# EAGLE design modul_zasilania (EAGLE 9.7.0)
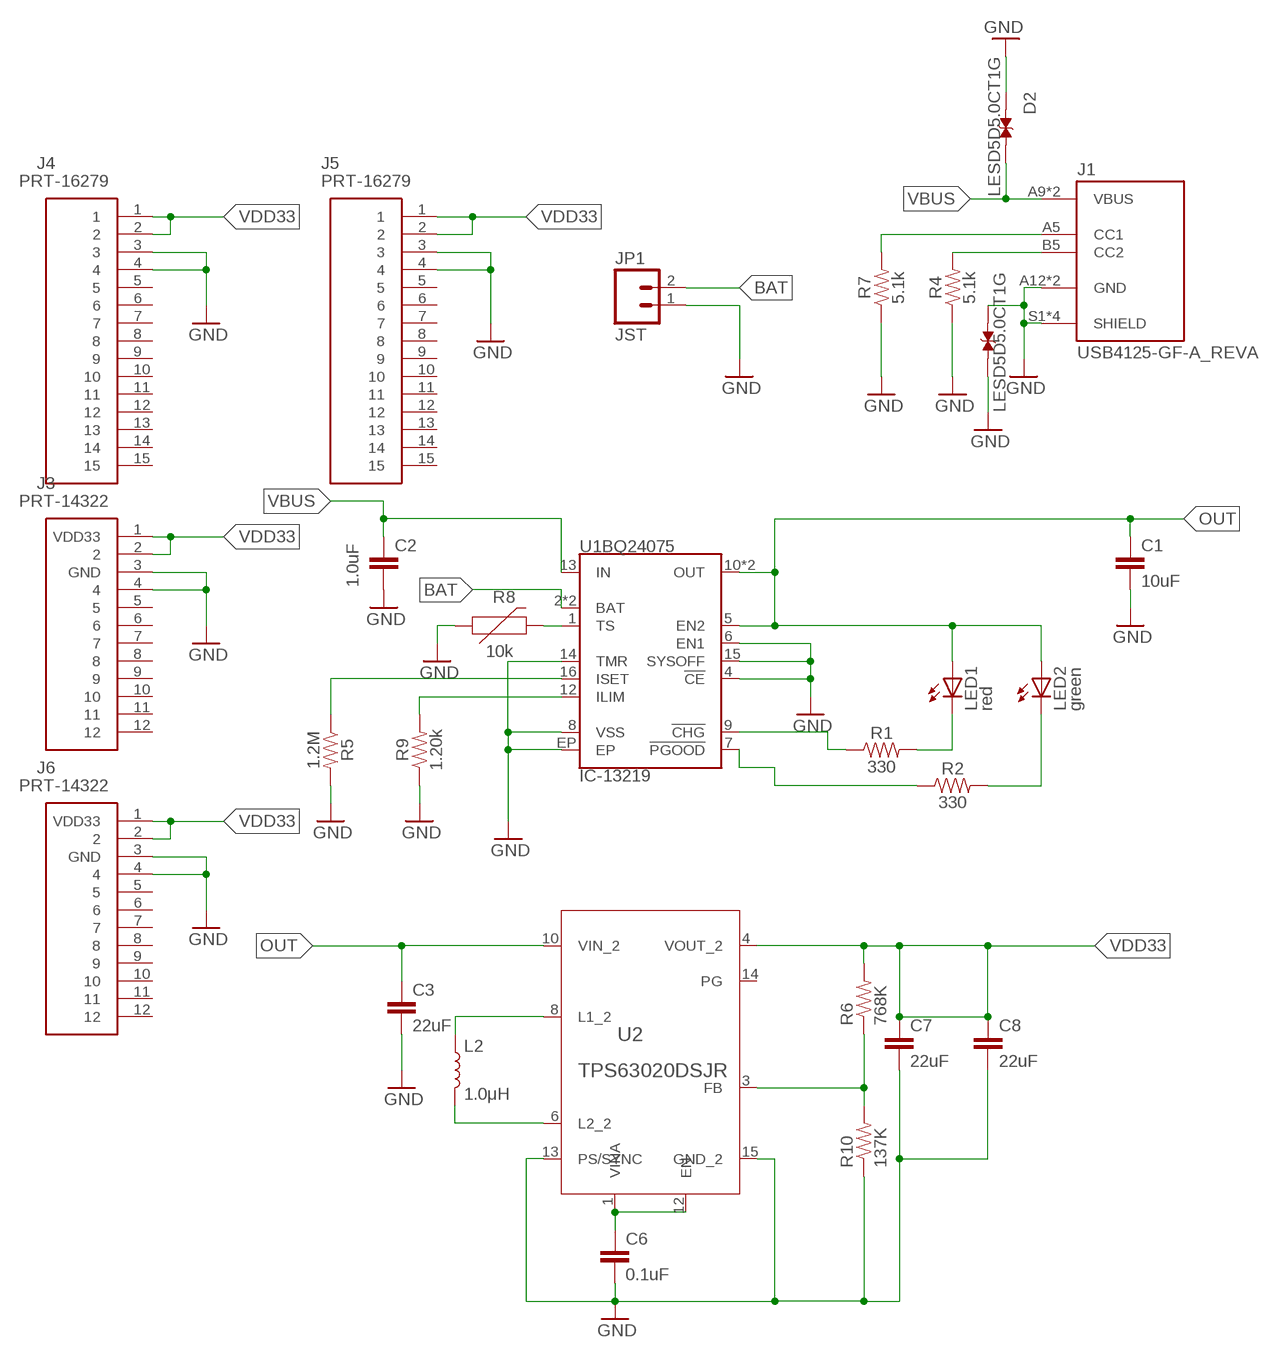
[diagram p0: schematic, sheet 1]

## Parts
C1  10uF  10UF-1206-6.3V-20%  [1206]
C2  1.0uF  1.0UF-0603-16V-10%  [0603]
C3  22uF  22UF-0603-6.3V-20%  [0603]
C6  0.1uF  0.1UF-0402-16V-10%  [0402]
C7  22uF  22UF-0603-6.3V-20%  [0603]
C8  22uF  22UF-0603-6.3V-20%  [0603]
D1  LESD5D5.0CT1G  [TVS_LESD5D5.0CT1G]
D2  LESD5D5.0CT1G  [TVS_LESD5D5.0CT1G]
J1  USB4125-GF-A_REVA  [GCT_USB4125-GF-A_REVA]
J3  PRT-14322  [RHDR12W87P0X254_1X12_3103X250X]
J4  PRT-16279  [PRT16279]
J5  PRT-16279  [PRT16279]
J6  PRT-14322  [RHDR12W87P0X254_1X12_3103X250X]
JP1  JST  M02-JST-2MM-SMT  [JST-2-SMD]
L2  1.0μH  1.0μH-0805_WIDE-1.0μH-1.4A-0.07OHM-1.4MM_H  [0805-WIDE]
LED1  red  LEDCHIP-LED0805  [CHIP-LED0805]
LED2  green  LEDCHIP-LED0805  [CHIP-LED0805]
R1  330  330OHM-0603-1/10W-1%  [0603]
R2  330  330OHM-0603-1/10W-1%  [0603]
R4  5.1k  5.1KOHM5.1KOHM-0603-1/10W-1%  [0603]
R5  1.2M  1.2MOHM-0603-1/10W-1%  [0603]
R6  768K  CRCW06034K70JNEAHP  [0603]
R7  5.1k  5.1KOHM5.1KOHM-0603-1/10W-1%  [0603]
R8  10k  NTC-THERMISTOR-0603  [0603@1]
R9  1.20k  1.20KOHM-0603-1/10W-1%  [0603]
R10  137K  CRCW06034K70JNEAHP  [0603]
U1BQ24075  IC-13219  BQ24075  [PVQFN-N16]
U2  TPS63020DSJR  [R-PVSON-N14]

## Nets
BAT [wires]: JP1.2 U1BQ24075.2(BAT) U1BQ24075.3(BAT)
GND [wires]: C1.2 C2.2 C3.2 C6.2 C7.2 C8.2 D1.1 D1.2 D2.1 J1.A12(GND) J1.B12(GND) J1.S1(SHIELD) J1.S2(SHIELD) J1.S3(SHIELD) J1.S4(SHIELD) J3.3(GND) J3.4 J4.3 J4.4 J5.3 J5.4 J6.3(GND) J6.4 JP1.1 R4.1 R5.2 R7.1 R8.1 R9.1 R10.1 U1BQ24075.4(!CE!) U1BQ24075.6(EN1) U1BQ24075.8(VSS) U1BQ24075.14(TMR) U1BQ24075.15(SYSOFF) U1BQ24075.EP U2.13(PS/SYNC) U2.15(GND_2)
LED1 [wires]: LED1.C R1.2
LED2 [wires]: LED2.C R2.2
N$1 [wires]: R8.2 U1BQ24075.1(TS)
N$2 [wires]: R5.1 U1BQ24075.16(ISET)
N$3 [wires]: J1.B5(CC2) R4.2
N$4 [wires]: J1.A5(CC1) R7.2
N$5 [wires]: R1.1 U1BQ24075.9(!CHG!)
N$6 [wires]: R2.1 U1BQ24075.7(!PGOOD!)
N$7 [wires]: R9.2 U1BQ24075.12(ILIM)
N$9 [wires]: L2.2 U2.6(L2_2)
N$10 [wires]: C6.1 U2.1(VINA) U2.12(EN)
N$11 [wires]: R6.1 R10.2 U2.3(FB)
N$12 [wires]: L2.1 U2.8(L1_2)
OUT [wires]: C1.1 C3.1 LED1.A LED2.A U1BQ24075.5(EN2) U1BQ24075.10(OUT) U1BQ24075.11(OUT) U2.10(VIN_2)
VBUS [wires]: C2.1 D2.2 J1.A9(VBUS) J1.B9(VBUS) U1BQ24075.13(IN)
VDD33 [wires]: C7.1 C8.1 J3.1(VDD33) J3.2 J4.1 J4.2 J5.1 J5.2 J6.1(VDD33) J6.2 R6.2 U2.4(VOUT_2)
Unconnected: J3.5 J3.6 J3.7 J3.8 J3.9 J3.10 J3.11 J3.12 J4.5 J4.6 J4.7 J4.8 J4.9 J4.10 J4.11 J4.12 J4.13 J4.14 J4.15 J5.5 J5.6 J5.7 J5.8 J5.9 J5.10 J5.11 J5.12 J5.13 J5.14 J5.15 J6.5 J6.6 J6.7 J6.8 J6.9 J6.10 J6.11 J6.12 U2.14(PG)

## Library data of the parts
C1 = SparkFun-Capacitors:10UF: 10.0µF ceramic capacitors A capacitor is a passive two-terminal electrical component used to store electrical energy temporarily in an electric field.; PROD_ID: CAP-10057
C2 = SparkFun-Capacitors:1.0UF: 1µF ceramic capacitors A capacitor is a passive two-terminal electrical component used to store electrical energy temporarily in an electric field.; PROD_ID: CAP-00868
C3 C7 C8 = SparkFun-Capacitors:22UF: 22µF ceramic capacitors A capacitor is a passive two-terminal electrical component used to store electrical energy temporarily in an electric field.; PROD_ID: CAP-14464
C6 = SparkFun-Capacitors:0.1UF: 0.1µF ceramic capacitors A capacitor is a passive two-terminal electrical component used to store electrical energy temporarily in an electric field.; PROD_ID: CAP-12416
D1 D2 = LESD5D5.0CT1G:LESD5D5.0CT1G: Check availability <https://pricing.snapeda.com/parts/LESD5D5.0CT1G/Leshan%20Radio%20Co./view-part?ref=eda>; AVAILABILITY: In Stock; CHECK_PRICES: https://www.snapeda.com/parts/LESD5D5.0CT1G/Leshan+Radio/view-part/?ref=eda; DESCRIPTION: Transient Voltage Suppressors for ESD Protection; MF: Leshan Radio Co.; MP: LESD5D5.0CT1G; PACKAGE: None; PRICE: None; SNAPEDA_LINK: https://www.snapeda.com/parts/LESD5D5.0CT1G/Leshan+Radio/view-part/?ref=snap
J1 = SMIW:USB4125-GF-A_REVA: USB 2.0 Type C Receptacle, Horizontal, SMT, For Power charging Check prices <https://pricing.snapeda.com/parts/USB4125-GF-A/Global%20Connector%20Technology/view-part?ref=eda>; AVAILABILITY: Warning; DESCRIPTION: USB Charge Only Connector Type C Horizontal Receptacle, 3.16mm profile, 6 Pins, Surface mount, Top mount, low cost; MF: Global Connector Technology; MP: USB4125-GF-A; PACKAGE: None; PRICE: None; PURCHASE-URL: https://pricing.snapeda.com/search/part/USB4125-GF-A/?ref=eda
J3 J6 = PRT-14322:PRT-14322: SparkFun Accessories Photon Stackable Header- 12 Pin Source: Datasheet <https://cdn.sparkfun.com/datasheets/Prototyping/SP-140520-XX-001.pdf>; DESCRIPTION: SparkFun Accessories Photon Stackable Header- 12 Pin; HEIGHT: 8.65mm; MANUFACTURER_NAME: SparkFun; MANUFACTURER_PART_NUMBER: PRT-14322; MOUSER_PART_NUMBER: 474-PRT-14322; MOUSER_PRICE-STOCK: https://www.mouser.co.uk/ProductDetail/SparkFun/PRT-14322?qs=YCa%2FAAYMW006l9RrtPHkxQ%3D%3D
J4 J5 = PRT-16279:PRT-16279: ARDUINO NANO STACKABLE HEADERS Source: Datasheet <https://cdn.sparkfun.com/assets/8/d/8/4/7/DS-16279-Arduino_Nano_Stackable_Header_Kit.pdf>; DESCRIPTION: ARDUINO NANO STACKABLE HEADERS; HEIGHT: 8.65mm; MANUFACTURER_NAME: SparkFun; MANUFACTURER_PART_NUMBER: PRT-16279; MOUSER_PART_NUMBER: 474-PRT-16279; MOUSER_PRICE-STOCK: https://www.mouser.co.uk/ProductDetail/SparkFun/PRT-16279?qs=vmHwEFxEFR8I6W1vfufYPg%3D%3D
JP1 = SparkFun:M02: Header 2 Standard 2-pin 0.1" header. Use with straight break away headers (SKU : PRT-00116), right angle break away headers (PRT-00553), swiss pins (PRT-00743), machine pins (PRT-00117), and female headers (PRT-00115). Molex polarized connector foot print use with SKU : PRT-08233 with associated crimp pins and housings.
L2 = SparkFun-Coils:1.0μH: 1.0μH Inductor Resist changes in electrical current. Basically a coil of wire. SparkFun Products: SparkFun Edge <https://www.sparkfun.com/products/15170>; PROD_ID: NDUC-14237
LED1 LED2 = adafruit:LED: LED OSRAM: - CHIPLED LG R971, LG N971, LY N971, LG Q971, LY Q971, LO R971, LY R971 LH N974, LH R974 LS Q976, LO Q976, LY Q976 LO Q996 - Hyper CHIPLED LW Q18S LB Q993, LB Q99A, LB R99A - SideLED LS A670, LO A670, LY A670, LG A670, LP A670 LB A673, LV A673, LT A673, LW A673 LH A674 LY A675 LS A676, LA A676, LO A676, LY A676, LW A676 LS A679, LY A679, LG A679 - Hyper Micro SIDELED® LS Y876, LA Y876, LO Y876, LY Y876 LT Y87S - SmartLED LW L88C, LW L88S LB L89C, LB L89S, LG L890 LS L89K, LO L89K, LY L89K LS L896, LA L896, LO L896, LY L896 - TOPLED LS T670, LO T670, LY T670, LG T670, LP T670 LSG T670, LSP T670, LSY T670, LOP T670, LYG T670 LG T671, LOG T671, LSG T671 LB T673, LV T673, LT T673, LW T673 LH T674 LS T676, LA T676, LO T676, LY T676, LB T676, LH T676, LSB T676, LW T676 LB T67C, LV T67C, LT T67C, LS T67K, LO T67K, LY T67K, LW E67C LS E67B, LA E67B, LO E67B, LY E67B, LB E67C, LV E67C, LT E67C LW T67C LS T679, LY T679, LG T679 LS T770, LO T770, LY T770, LG T770, LP T770 LB T773, LV T773, LT T773, LW T773 LH T774 LS E675, LA E675, LY E675, LS T675 LS T776, LA T776, LO T776, LY T776, LB T776 LHGB T686 LT T68C, LB T68C - Hyper Mini TOPLED® LB M676 - Mini TOPLED Santana® LG M470 LS M47K, LO M47K, LY M47K Source: http://www.osram.convergy.de/
R1 R2 = SparkFun-Resistors:330OHM: 330Ω resistor A resistor is a passive two-terminal electrical component that implements electrical resistance as a circuit element. Resistors act to reduce current flow, and, at the same time, act to lower voltage levels within circuits. - Wikipedia; PROD_ID: RES-00818
R4 R7 = SparkFun-Resistors:5.1KOHM; PROD_ID: RES-12083
R5 = SparkFun-Resistors:1.2MOHM: 1.2MΩ resistor A resistor is a passive two-terminal electrical component that implements electrical resistance as a circuit element. Resistors act to reduce current flow, and, at the same time, act to lower voltage levels within circuits. - Wikipedia; PROD_ID: RES-10055
R6 R10 = Volks73-VishayDale:CRCW?*: Resistor Pulse Proof, High Power Thick Film Chip Resistors Documentation Datasheet <http://www.vishay.com/docs/20043/crcwhpe3.pdf> Features Excellent pulse load capability Enhanced power rating Double side printed resistor element Protective overglaze Pure tin solder contacts on Ni barrier layer provides compatibility with lead (Pb)-free and lead containing soldering processes AEC-Q200 qualified, rev. C compliant; CATEGORY: Resistors; COMPOSITION: Thick Film; DESCRIPTION: RES SMD 4.7K OHM 5% 1/4W 0603; DOCUMENTATION_LINK: <a href="http://www.vishay.com/docs/20043/crcwhpe3.pdf">Datasheet</a>; DOCUMENTATION_URL: http://www.vishay.com/docs/20043/crcwhpe3.pdf; FAMILY: Chip Resistor - Surface Mount; FEATURES: Automotive AEC-Q200, Pulse Withstanding; HEIGHT: 0.022" (0.55mm); MANUFACTURER: Vishay Dale; NUMBER_OF_TERMINATIONS: 2; OPEARTING_TEMPERATURE: -55°C ~ 155°C; PACKAGE: 0603 (1608 Metric); PART_NUMBER: CRCW06034K70JNEAHP; POWER: 0.25W, 1/4W; RESISTANCE: 4.7k; SERIES: CRCW-HP; SIZE: 0.063" L x 0.033" W (1.60mm x 0.85mm); SUPPLIER_DEVICE_PACKAGE: 0603 (1608 Metric); SUPPLIER_ITEM_LINK: <a href="http://www.digikey.com/product-detail/en/CRCW06034K70JNEAHP/541-4.7KSACT-ND/2222815">Details</a>; SUPPLIER_ITEM_NUMBER: 541-4.7KSACT-ND; SUPPLIER_ITEM_URL: http://www.digikey.com/product-detail/en/CRCW06034K70JNEAHP/541-4.7KSACT-ND/2222815; SUPPLIER_NAME: Digi-Key; TEMPERATURE_COEFFICIENT: ±200ppm/°C; TOLERANCE: ±5%
R8 = SparkFun-Resistors:NTC-THERMISTOR: NTC Thermistor An NTC thermistor's resistance decreases as temperature rises. Applications: Resistance Thermometer - temperature monitoring Inrush current limiter Heat source; PROD_ID: RES-13608
R9 = SparkFun-Resistors:1.20KOHM: 1.20kΩ resistor A resistor is a passive two-terminal electrical component that implements electrical resistance as a circuit element. Resistors act to reduce current flow, and, at the same time, act to lower voltage levels within circuits. - Wikipedia; PROD_ID: RES-08413
U1BQ24075 = SparkFun-IC-Power:BQ24075: Texas Instruments BQ24075 LiPo Battery Chargerand Power-Path Management IC The bq2407x series of devices are integrated Li-Ion linear chargers and system power path management devices targeted at space-limited portable applications. The devices operate from either a USB port or an AC adapter and support charge currents up to 1.5 A. The input voltage range with input overvoltage protection supports unregulated adapters. The USB input current limit accuracy and start up sequence allow the bq2407x to meet USB-IF inrush current specifications. Additionally, the input dynamic power management (VIN-DPM) prevents the charger from crashing incorrectly configured USB sources. Datasheet <http://www.ti.com/product/BQ24075/datasheet> SparkFun Products SparkFun Battery Babysitter <https://www.sparkfun.com/products/13777> (PRT-13777); PROD_ID: IC-13219
U2 = untitled:TPS63020DSJR; MANUFACTURER_PART_NUMBER: TPS63020DSJR; VENDOR: Texas Instruments

## Board
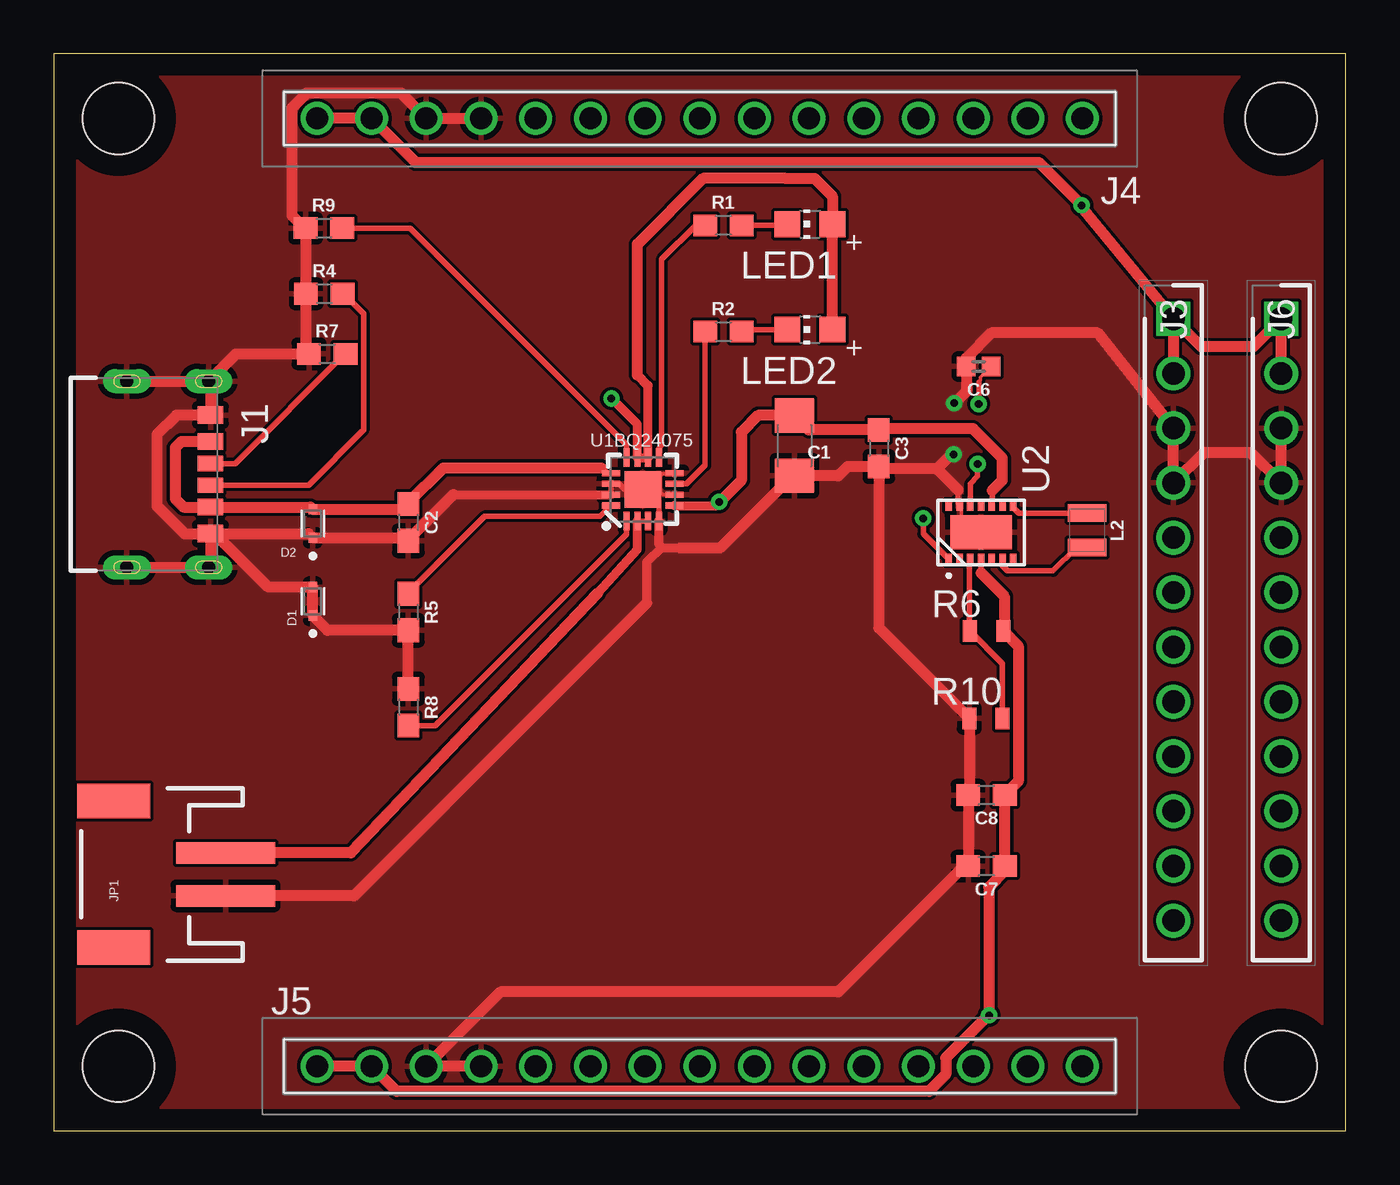
[diagram p1: board, top side]
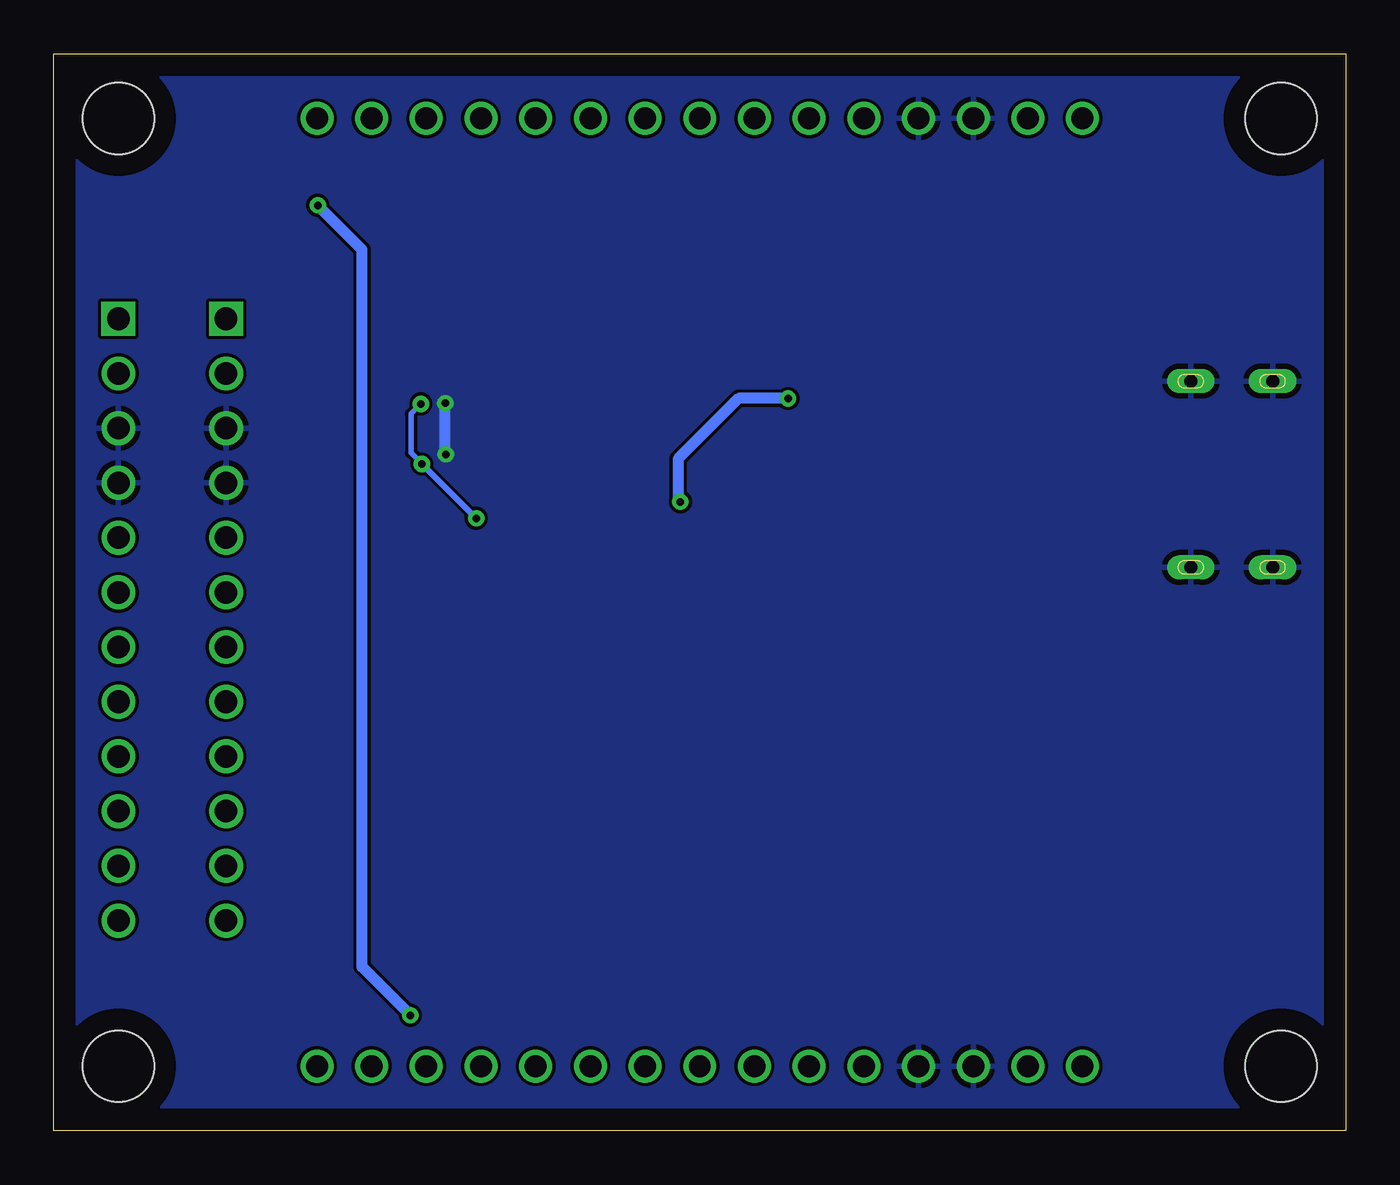
[diagram p2: board, bottom side, seen from below]

Size 60 x 50 mm. Coordinates in mm from the lower left corner, seen from the top.
Outline: 0,0 60,0 60,50 0,50 0,0
Copper layers (1*16): Top 0.035mm / dielectric 1.5mm / Bottom 0.035mm
Design rules "Fusion Electronics Design Rules *": minimum track width 6mil, minimum drill 0.35mm, track to track 6mil, track to pad 6mil, pad to pad 6mil, via to via 6mil, smd to smd 6mil, copper to edge 40mil, drill to drill 6mil, minimum pad ring 10mil, minimum via ring 8mil, stop-mask expansion 4mil, vias tented up to drill 9999mil, thermal gap 10mil

### Footprints (pad centres in the part's own frame; a part is rotated, then mirrored left to right if it is on the bottom)
1206 = smd 1.6 x 1.8: 1 -1.4,0; 2 1.4,0
0603 = smd 1.1 x 1: 1 -0.85,0; 2 0.85,0
0402 = smd 0.85 x 0.9: 1 -0.58,0; 2 0.58,0
TVS_LESD5D5.0CT1G = smd 0.48 x 0.4: 1 -0.66,0; 2 0.66,0
GCT_USB4125-GF-A_REVA = smd 0.7 x 1.2: A5 -0.5,0.08; B5 0.5,0.08 | smd 0.76 x 1.2: A9 1.52,0.08; B9 -1.52,0.08 | smd 0.8 x 1.2: A12 2.75,0.08; B12 -2.75,0.08 | drill 0.6 pad 1.1 long: S1 -4.32,0; S2 4.32,0; S3 -4.32,-3.8; S4 4.32,-3.8
RHDR12W87P0X254_1X12_3103X250X = drill 1.05 pad 1.575 square: 1 -12.7,0 | drill 1.05 pad 1.575: 2 -10.16,0; 3 -7.62,0; 4 -5.08,0; 5 -2.54,0; 6 0,0; 7 2.54,0; 8 5.08,0; 9 7.62,0; 10 10.16,0; 11 12.7,0; 12 15.24,0
PRT16279 = drill 1.02 pad 1.53: 1 -17.78,0; 2 -15.24,0; 3 -12.7,0; 4 -10.16,0; 5 -7.62,0; 6 -5.08,0; 7 -2.54,0; 8 0,0; 9 2.54,0; 10 5.08,0; 11 7.62,0; 12 10.16,0; 13 12.7,0; 14 15.24,0; 15 17.78,0
JST-2-SMD = smd 1 x 4.6: 1 -1,-3.7; 2 1,-3.7 | smd 1.6 x 3.4: NC1 -3.4,1.5; NC2 3.4,1.5
0805-WIDE = smd 0.8 x 1.8: 1 -0.8,0; 2 0.8,0
CHIP-LED0805 = smd 1.2 x 1.2: A 0,-1.05; C 0,1.05
0603' = smd 0.65 x 1: 1 -0.775,0; 2 0.775,0
0603@1 = smd 1.1 x 1: 1 -0.85,0; 2 0.85,0
STAND-OFF = hole 3.302: 0,0
PVQFN-N16 = smd 0.28 x 0.85: 1 -0.75,-1.475; 2 -0.25,-1.475; 3 0.25,-1.475; 4 0.75,-1.475; 9 0.75,1.475; 10 0.25,1.475; 11 -0.25,1.475; 12 -0.75,1.475 | smd 0.85 x 0.28: 5 1.475,-0.75; 6 1.475,-0.25; 7 1.475,0.25; 8 1.475,0.75; 13 -1.475,0.75; 14 -1.475,0.25; 15 -1.475,-0.25; 16 -1.475,-0.75 | smd 1.7 x 1.7: EP 0,0
R-PVSON-N14 = smd 0.5 x 0.3: 1 -1.25,1.5; 2 -1.25,1; 3 -1.25,0.5; 4 -1.25,0; 5 -1.25,-0.5; 6 -1.25,-1; 7 -1.25,-1.5; 8 1.25,-1.5; 9 1.25,-1; 10 1.25,-0.5; 11 1.25,0; 12 1.25,0.5; 13 1.25,1; 14 1.25,1.5 | smd 1.58 x 2.85: 15 0,0

### Placement (x,y rotation side)
C1  34.4,31.81 270 top
C2  16.47,28.25 270 top
C3  38.32,31.69 270 top
C6  42.96,35.48 180 top
C7  43.32,12.29 180 top
C8  43.32,15.59 180 top
D1  12.02,24.58 90 top
D2  12.02,28.19 90 top
J1  7.19,30.48 270 top
J3  52,25 270 top
J4  30,47 0 top
J5  30,3 0 top
J6  57,25 270 top
JP1  4.28,11.9 90 top
L2  47.99,27.88 270 top
LED1  35.11,42.09 90 top
LED2  35.11,37.2 90 top
R1  31.1,42.04 0 top
R2  31.1,37.1 0 top
R4  12.56,38.86 0 top
R5  16.47,24.08 270 top
R6  768K  [0603']  43.32,23.21 0 top
R7  12.7,36.07 0 top
R8  16.47,19.67 270 top
R9  12.54,41.91 0 top
R10  137K  [0603']  43.29,19.14 0 top
STANDOFF1  STAND-OFF  [STAND-OFF]  3,3 0 top
STANDOFF2  STAND-OFF  [STAND-OFF]  57,3 0 top
STANDOFF3  STAND-OFF  [STAND-OFF]  3,47 90 top
STANDOFF4  STAND-OFF  [STAND-OFF]  57,47 0 top
U1BQ24075  27.35,29.78 0 top
U2  43.06,27.78 90 top

### Tracks (layer width: path | path; a pad name or v marks a point on that pad's centre or on a via)
BAT
  Top 0.254: U1BQ24075.2 U1BQ24075.3
  Top 0.406: 25.26,24.96 27.1,27 U1BQ24075.2
  Top 0.508: 25.26,24.96 13.79,12.9 JP1.2
GND  (via drill 0.35)
  Top 0.152: 41.02,30.74 41.01,30.74 | 11.83,27.73 D2.1 | 16.47,27.45 C2.2 16.33,27.53 | C1.2 34.3,30.41 | R7.1 11.71,36.2 | U1BQ24075.8 28.82,30.52 28.53,30.52 28.5,30.5 28.27,30.5 28.17,30.4 | U1BQ24075.14 26.26,30.03 | 38.42,30.74 C3.2 | 42,29.15 U2.13 42.15,29 42.15,28.09 U2.15 | 42.52,15.64 C8.2 | 28.17,30.4 27.55,29.78 U1BQ24075.EP | 28.17,30.4 28.17,29.66 28.3,29.53 U1BQ24075.6
  Top 0.254: U1BQ24075.15 U1BQ24075.14 | 26.26,30.03 26.51,29.78 U1BQ24075.EP 28.1,29.2 U1BQ24075.4 | 42,29.15 42,29.76 | 41.69,31.41 v41.79,31.41
  Top 0.406: 18.55,29.53 U1BQ24075.15 | U1BQ24075.4 28.1,27.24 28.24,27.1 | 29.1,27.05 28.29,27.05 28.24,27.1 | 28.24,27.1 27.54,26.4 27.54,24.5
  Top 0.508: J1.S1 8.46,36.07 R7.1 | 11.71,36.2 R4.1 11.71,41.89 R9.1 11.64,41.91 11.05,42.5 11.05,47.48 11.73,48.17 16.13,48.17 J4.3 J4.4 | C8.2 C7.2 42.27,12.29 36.43,6.45 20.75,6.45 J5.3 J5.4 | 38.42,30.74 41.01,30.74 42,29.76 | 42.52,15.64 R10.1 38.32,23.34 C3.2 36.87,30.84 36.44,30.41 C1.2 | v41.82,33.78 42.38,34.33 C6.2 42.38,35.87 43.55,37.04 48.48,37.04 J3.3 J3.4 53.4,31.48 55.6,31.48 J6.4 J6.3 | 41.02,30.74 41.69,31.41 | 16.47,27.45 18.55,29.53 | 34.3,30.41 30.93,27.05 29.1,27.05 | D2.1 16.33,27.53 | J1.A12 11.83,27.73 | 27.54,24.5 13.94,10.9 JP1.1 | J1.A12 7.47,27.73 9.96,25.24 D1.2 D1.1 12.71,23.23 R5.2 R8.1 | J1.A12 7.25,27.7 6.09,27.7 4.79,29.01 4.79,32.32 5.7,33.23 J1.B12 7.27,34.72 J1.S1 | J1.S4 J1.S2 7.27,26.24 J1.A12 | J1.S3 J1.S1
  Bottom 0.152: v41.79,31.41 41.82,31.44
  Bottom 0.508: 41.82,31.44 v41.82,33.78
  pour Top: 0.08,0.08 59.92,0.08 59.92,49.92 0.08,49.92
  pour Bottom: 0.08,0.08 59.92,0.08 59.92,49.93 0.06,49.88
LED1
  Top 0.152: 34.01,42.04 LED1.C
  Top 0.254: R1.2 34.01,42.04
LED2
  Top 0.152: 32.05,37.2 R2.2
  Top 0.254: LED2.C 32.05,37.2
N$1
  Top 0.254: U1BQ24075.1 26.6,27.7 17.71,18.82 R8.2
N$2
  Top 0.152: 16.47,24.98 R5.1
  Top 0.254: U1BQ24075.16 25.38,28.53 20.01,28.53 16.47,24.98
N$3
  Top 0.152: R4.2 13.46,38.86
  Top 0.254: 13.46,38.86 14.33,38 14.38,37.95 14.38,32.53 14.33,32.48 11.83,29.98 J1.B5
N$4
  Top 0.152: R7.2 13.5,36.07
  Top 0.254: 13.5,36.07 8.41,30.98 J1.A5
N$5
  Top 0.152: R1.1 29.82,42.04
  Top 0.254: U1BQ24075.9 28.1,31.7 28.23,31.83 28.23,40.45 29.82,42.04
N$6
  Top 0.254: R2.1 30.25,30.89 29.39,30.03 U1BQ24075.7
N$7
  Top 0.254: R9.2 16.55,41.91 26.6,31.86 U1BQ24075.12
N$9
  Top 0.254: L2.2 47.49,27.08 46.41,26 44.3,26 44.06,26.23 U2.6
N$10  (via drill 0.35)
  Top 0.152: 41.54,26.56 U2.1 | C6.1 43.03,34.98 43.03,34.84 42.95,34.76 | U2.12
  Top 0.254: 41.54,26.56 40.38,27.72 v40.38,28.44 | 42.95,34.76 v42.95,33.75 | U2.12 42.56,30.04 42.91,30.38 v42.91,30.95
  Bottom 0.254: 42.9,30.95 40.48,28.54 v40.38,28.44 | 42.9,30.95 v42.91,30.95 | 42.9,30.95 43.41,31.47 43.41,33.29 v42.95,33.75
N$11
  Top 0.152: 42.54,26.51 U2.3 | R6.1
  Top 0.254: R10.2 44.07,21.68 R6.1 42.53,26.5 42.54,26.51
N$12
  Top 0.254: 47.49,28.68 L2.1 47.49,28.68 | 47.49,28.68 44.81,28.68 44.56,28.93 U2.8
OUT  (via drill 0.35)
  Top 0.152: 34.03,44.22 33.98,44.22 33.98,44.2 34.03,44.22
  Top 0.254: 43.59,29.74 43.59,29.05 U2.10
  Top 0.406: v25.9,34 27.1,32.8 U1BQ24075.11 U1BQ24075.10 27.6,34.6 27.1,35.1 | U1BQ24075.5 30.77,29.03 30.94,29.2
  Top 0.508: LED2.A LED1.A 36.16,43.39 35.33,44.22 34.03,44.22 | 33.98,44.22 30.16,44.22 27.1,41.16 27.1,35.1 | 43.59,29.74 44.05,30.2 44.05,31.23 42.69,32.59 38.46,32.59 C3.1 35.07,32.54 C1.1 32.71,33.21 31.93,32.43 31.93,30.2 30.94,29.2 v30.9,29.2
  Bottom 0.508: v25.9,34 28.2,34 31,31.2 31,29.3 v30.9,29.2
VBUS
  Top 0.152: 11.92,28.96 D2.2 | 25.69,30.53 U1BQ24075.13 | 16.47,28.85 C2.1 16.47,29.15
  Top 0.254: 25.44,30.78 25.69,30.53
  Top 0.508: D2.2 16.47,28.85 | 16.47,29.15 18.1,30.78 25.44,30.78 | 11.92,28.96 J1.A9 6.02,28.96 5.64,29.34 5.64,31.72 5.92,32 J1.B9
VDD33  (via drill 0.35)
  Top 0.254: U2.4 43.06,25.9
  Top 0.508: 43.06,25.9 44.15,24.82 44.15,23.26 R6.2 44.8,22.5 44.8,16.22 C8.1 C7.1 44.17,12.06 43.42,11.31 43.42,5.38 v43.44,5.36 43.41,5.36 41.43,3.39 41.43,2.61 40.65,1.83 15.93,1.83 J5.2 J5.1 | J4.1 J4.2 16.8,44.96 45.75,44.96 v47.74,42.97 47.74,42.86 J3.1 | J3.1 J3.2 | J3.1 53.3,36.4 55.7,36.4 J6.1 J6.2
  Bottom 0.508: v43.44,5.36 45.69,7.61 45.69,40.91 v47.74,42.97